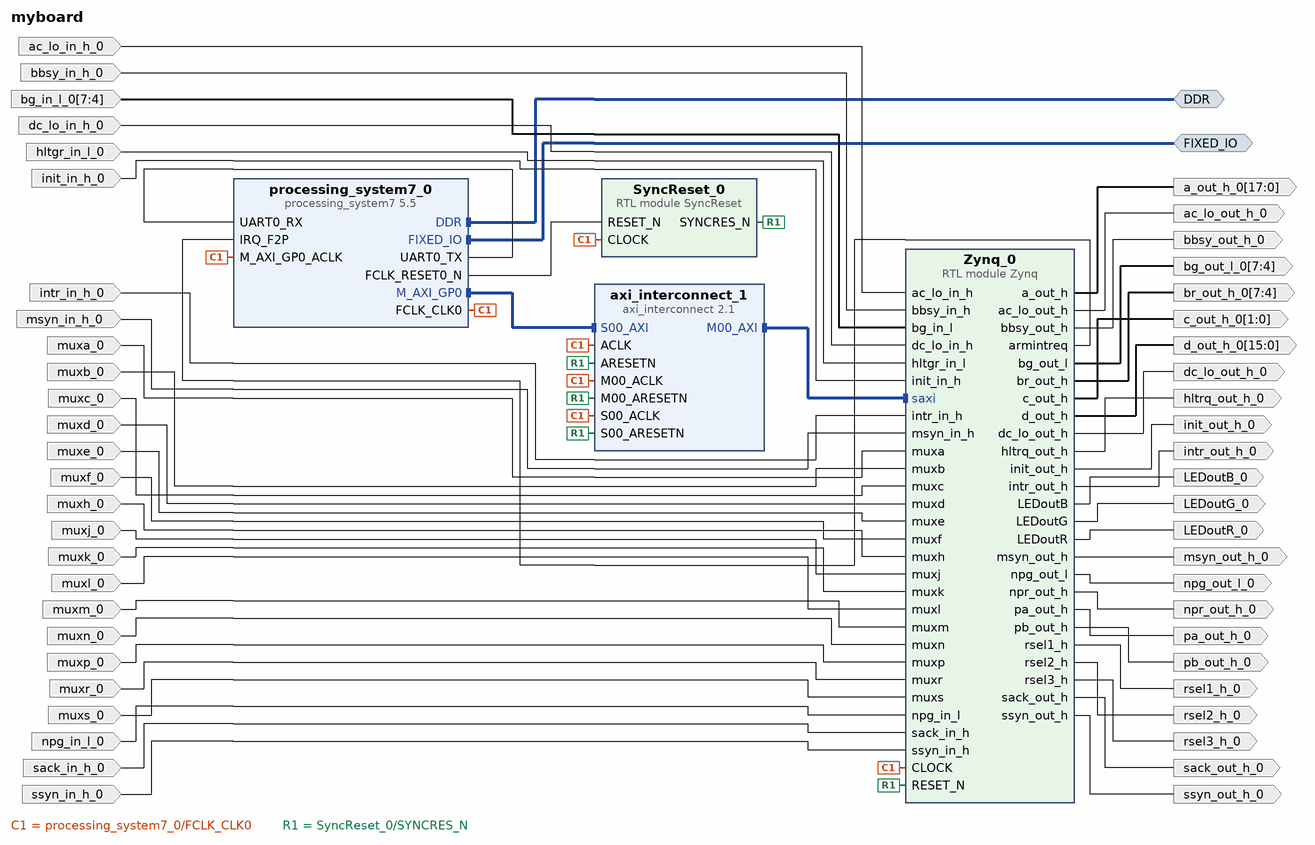
[diagram p0: block diagram of the top level]
# Vivado block design myboard, xc7z020clg400-1, Vivado 2018.3
create_bd_design myboard

create_bd_intf_port -mode Master -vlnv xilinx.com:interface:ddrx_rtl:1.0 DDR
create_bd_intf_port -mode Master -vlnv xilinx.com:display_processing_system7:fixedio_rtl:1.0 FIXED_IO
create_bd_port -dir O -type data LEDoutB_0
create_bd_port -dir O -type data LEDoutG_0
create_bd_port -dir O -type data LEDoutR_0
create_bd_port -dir O -from 17 -to 0 a_out_h_0
create_bd_port -dir I ac_lo_in_h_0
create_bd_port -dir O ac_lo_out_h_0
create_bd_port -dir I bbsy_in_h_0
create_bd_port -dir O bbsy_out_h_0
create_bd_port -dir I -from 7 -to 4 bg_in_l_0
create_bd_port -dir O -from 7 -to 4 bg_out_l_0
create_bd_port -dir O -from 7 -to 4 br_out_h_0
create_bd_port -dir O -from 1 -to 0 c_out_h_0
create_bd_port -dir O -from 15 -to 0 d_out_h_0
create_bd_port -dir I dc_lo_in_h_0
create_bd_port -dir O dc_lo_out_h_0
create_bd_port -dir I hltgr_in_l_0
create_bd_port -dir O hltrq_out_h_0
create_bd_port -dir I init_in_h_0
create_bd_port -dir O init_out_h_0
create_bd_port -dir I intr_in_h_0
create_bd_port -dir O intr_out_h_0
create_bd_port -dir I msyn_in_h_0
create_bd_port -dir O msyn_out_h_0
create_bd_port -dir I muxa_0
create_bd_port -dir I muxb_0
create_bd_port -dir I muxc_0
create_bd_port -dir I muxd_0
create_bd_port -dir I muxe_0
create_bd_port -dir I muxf_0
create_bd_port -dir I muxh_0
create_bd_port -dir I muxj_0
create_bd_port -dir I muxk_0
create_bd_port -dir I muxl_0
create_bd_port -dir I muxm_0
create_bd_port -dir I muxn_0
create_bd_port -dir I muxp_0
create_bd_port -dir I muxr_0
create_bd_port -dir I muxs_0
create_bd_port -dir I npg_in_l_0
create_bd_port -dir O npg_out_l_0
create_bd_port -dir O npr_out_h_0
create_bd_port -dir O pa_out_h_0
create_bd_port -dir O pb_out_h_0
create_bd_port -dir O rsel1_h_0
create_bd_port -dir O rsel2_h_0
create_bd_port -dir O rsel3_h_0
create_bd_port -dir I sack_in_h_0
create_bd_port -dir O sack_out_h_0
create_bd_port -dir I ssyn_in_h_0
create_bd_port -dir O ssyn_out_h_0

create_bd_cell -type module -reference SyncReset SyncReset_0
create_bd_cell -type module -reference Zynq Zynq_0
create_bd_cell -type ip -vlnv xilinx.com:ip:axi_interconnect:2.1 axi_interconnect_1
set_property -dict {CONFIG.NUM_MI 1} [get_bd_cells axi_interconnect_1]
create_bd_cell -type ip -vlnv xilinx.com:ip:processing_system7:5.5 processing_system7_0
set_property -dict [list \
  CONFIG.PCW_APU_PERIPHERAL_FREQMHZ 666.666666 \
  CONFIG.PCW_CAN0_CAN0_IO {MIO 14 .. 15} \
  CONFIG.PCW_CAN0_PERIPHERAL_ENABLE 1 \
  CONFIG.PCW_ENET0_ENET0_IO {MIO 16 .. 27} \
  CONFIG.PCW_ENET0_GRP_MDIO_ENABLE 1 \
  CONFIG.PCW_ENET0_GRP_MDIO_IO {MIO 52 .. 53} \
  CONFIG.PCW_ENET0_PERIPHERAL_CLKSRC {ARM PLL} \
  CONFIG.PCW_ENET0_PERIPHERAL_ENABLE 1 \
  CONFIG.PCW_ENET0_RESET_ENABLE 0 \
  CONFIG.PCW_ENET_RESET_ENABLE 1 \
  CONFIG.PCW_ENET_RESET_SELECT {Share reset pin} \
  CONFIG.PCW_EN_CLK1_PORT 1 \
  CONFIG.PCW_FCLK_CLK1_BUF TRUE \
  CONFIG.PCW_FPGA0_PERIPHERAL_FREQMHZ 100 \
  CONFIG.PCW_FPGA1_PERIPHERAL_FREQMHZ 50 \
  CONFIG.PCW_FPGA_FCLK1_ENABLE 1 \
  CONFIG.PCW_GPIO_MIO_GPIO_ENABLE 1 \
  CONFIG.PCW_GPIO_MIO_GPIO_IO MIO \
  CONFIG.PCW_GPIO_PERIPHERAL_ENABLE 1 \
  CONFIG.PCW_I2C0_I2C0_IO EMIO \
  CONFIG.PCW_I2C0_PERIPHERAL_ENABLE 1 \
  CONFIG.PCW_I2C1_I2C1_IO {MIO 12 .. 13} \
  CONFIG.PCW_I2C1_PERIPHERAL_ENABLE 1 \
  CONFIG.PCW_I2C_PERIPHERAL_FREQMHZ 83.333336 \
  CONFIG.PCW_I2C_RESET_ENABLE 1 \
  CONFIG.PCW_I2C_RESET_SELECT {Share reset pin} \
  CONFIG.PCW_IRQ_F2P_INTR 1 \
  CONFIG.PCW_PRESET_BANK1_VOLTAGE {LVCMOS 1.8V} \
  CONFIG.PCW_QSPI_GRP_FBCLK_ENABLE 1 \
  CONFIG.PCW_QSPI_GRP_FBCLK_IO {MIO 8} \
  CONFIG.PCW_QSPI_GRP_SINGLE_SS_ENABLE 1 \
  CONFIG.PCW_QSPI_GRP_SINGLE_SS_IO {MIO 1 .. 6} \
  CONFIG.PCW_QSPI_PERIPHERAL_ENABLE 1 \
  CONFIG.PCW_QSPI_QSPI_IO {MIO 1 .. 6} \
  CONFIG.PCW_SD0_GRP_CD_ENABLE 1 \
  CONFIG.PCW_SD0_GRP_CD_IO {MIO 46} \
  CONFIG.PCW_SD0_GRP_WP_ENABLE 1 \
  CONFIG.PCW_SD0_GRP_WP_IO {MIO 47} \
  CONFIG.PCW_SD0_PERIPHERAL_ENABLE 1 \
  CONFIG.PCW_SD0_SD0_IO {MIO 40 .. 45} \
  CONFIG.PCW_SDIO_PERIPHERAL_FREQMHZ 100 \
  CONFIG.PCW_SINGLE_QSPI_DATA_MODE x4 \
  CONFIG.PCW_TTC0_PERIPHERAL_ENABLE 1 \
  CONFIG.PCW_TTC0_TTC0_IO EMIO \
  CONFIG.PCW_UART0_PERIPHERAL_ENABLE 1 \
  CONFIG.PCW_UART0_UART0_IO EMIO \
  CONFIG.PCW_UART1_PERIPHERAL_ENABLE 1 \
  CONFIG.PCW_UART1_UART1_IO {MIO 48 .. 49} \
  CONFIG.PCW_UART_PERIPHERAL_FREQMHZ 100 \
  CONFIG.PCW_UIPARAM_DDR_PARTNO {MT41J256M16 RE-125} \
  CONFIG.PCW_USB0_PERIPHERAL_ENABLE 1 \
  CONFIG.PCW_USB0_RESET_ENABLE 1 \
  CONFIG.PCW_USB0_RESET_IO {MIO 51} \
  CONFIG.PCW_USB0_USB0_IO {MIO 28 .. 39} \
  CONFIG.PCW_USB_RESET_ENABLE 1 \
  CONFIG.PCW_USB_RESET_SELECT {Share reset pin} \
  CONFIG.PCW_USE_FABRIC_INTERRUPT 1 \
] [get_bd_cells processing_system7_0]
# 287 more settings of processing_system7_0 are not shown: defaults, MIO pin electricals, DDR timing, and values the tool derives

# ---- connections ----

connect_bd_intf_net [get_bd_intf_pins axi_interconnect_1/M00_AXI] [get_bd_intf_pins Zynq_0/saxi]
connect_bd_intf_net [get_bd_intf_ports DDR] [get_bd_intf_pins processing_system7_0/DDR]
connect_bd_intf_net [get_bd_intf_ports FIXED_IO] [get_bd_intf_pins processing_system7_0/FIXED_IO]
connect_bd_intf_net [get_bd_intf_pins processing_system7_0/M_AXI_GP0] [get_bd_intf_pins axi_interconnect_1/S00_AXI]
connect_bd_net [get_bd_pins Zynq_0/LEDoutB] [get_bd_ports LEDoutB_0]
connect_bd_net [get_bd_pins Zynq_0/LEDoutG] [get_bd_ports LEDoutG_0]
connect_bd_net [get_bd_pins Zynq_0/LEDoutR] [get_bd_ports LEDoutR_0]
connect_bd_net [get_bd_pins Zynq_0/a_out_h] [get_bd_ports a_out_h_0]
connect_bd_net [get_bd_pins Zynq_0/ac_lo_out_h] [get_bd_ports ac_lo_out_h_0]
connect_bd_net [get_bd_pins Zynq_0/armintreq] [get_bd_pins processing_system7_0/IRQ_F2P]
connect_bd_net [get_bd_pins Zynq_0/bbsy_out_h] [get_bd_ports bbsy_out_h_0]
connect_bd_net [get_bd_pins Zynq_0/bg_out_l] [get_bd_ports bg_out_l_0]
connect_bd_net [get_bd_pins Zynq_0/br_out_h] [get_bd_ports br_out_h_0]
connect_bd_net [get_bd_pins Zynq_0/c_out_h] [get_bd_ports c_out_h_0]
connect_bd_net [get_bd_pins Zynq_0/d_out_h] [get_bd_ports d_out_h_0]
connect_bd_net [get_bd_pins Zynq_0/dc_lo_out_h] [get_bd_ports dc_lo_out_h_0]
connect_bd_net [get_bd_pins Zynq_0/hltrq_out_h] [get_bd_ports hltrq_out_h_0]
connect_bd_net [get_bd_pins Zynq_0/init_out_h] [get_bd_ports init_out_h_0]
connect_bd_net [get_bd_pins Zynq_0/intr_out_h] [get_bd_ports intr_out_h_0]
connect_bd_net [get_bd_pins Zynq_0/msyn_out_h] [get_bd_ports msyn_out_h_0]
connect_bd_net [get_bd_pins Zynq_0/npg_out_l] [get_bd_ports npg_out_l_0]
connect_bd_net [get_bd_pins Zynq_0/npr_out_h] [get_bd_ports npr_out_h_0]
connect_bd_net [get_bd_pins Zynq_0/pa_out_h] [get_bd_ports pa_out_h_0]
connect_bd_net [get_bd_pins Zynq_0/pb_out_h] [get_bd_ports pb_out_h_0]
connect_bd_net [get_bd_pins Zynq_0/rsel1_h] [get_bd_ports rsel1_h_0]
connect_bd_net [get_bd_pins Zynq_0/rsel2_h] [get_bd_ports rsel2_h_0]
connect_bd_net [get_bd_pins Zynq_0/rsel3_h] [get_bd_ports rsel3_h_0]
connect_bd_net [get_bd_pins Zynq_0/sack_out_h] [get_bd_ports sack_out_h_0]
connect_bd_net [get_bd_pins Zynq_0/ssyn_out_h] [get_bd_ports ssyn_out_h_0]
connect_bd_net -net ac_lo_in_h_0_1 [get_bd_ports ac_lo_in_h_0] [get_bd_pins Zynq_0/ac_lo_in_h]
connect_bd_net -net bbsy_in_h_0_1 [get_bd_ports bbsy_in_h_0] [get_bd_pins Zynq_0/bbsy_in_h]
connect_bd_net -net bg_in_l_0_1 [get_bd_ports bg_in_l_0] [get_bd_pins Zynq_0/bg_in_l]
connect_bd_net -net dc_lo_in_h_0_1 [get_bd_ports dc_lo_in_h_0] [get_bd_pins Zynq_0/dc_lo_in_h]
connect_bd_net -net hltgr_in_l_0_1 [get_bd_ports hltgr_in_l_0] [get_bd_pins Zynq_0/hltgr_in_l]
connect_bd_net -net init_in_h_0_1 [get_bd_ports init_in_h_0] [get_bd_pins Zynq_0/init_in_h]
connect_bd_net -net intr_in_h_0_1 [get_bd_ports intr_in_h_0] [get_bd_pins Zynq_0/intr_in_h]
connect_bd_net -net msyn_in_h_0_1 [get_bd_ports msyn_in_h_0] [get_bd_pins Zynq_0/msyn_in_h]
connect_bd_net -net muxa_0_1 [get_bd_ports muxa_0] [get_bd_pins Zynq_0/muxa]
connect_bd_net -net muxb_0_1 [get_bd_ports muxb_0] [get_bd_pins Zynq_0/muxb]
connect_bd_net -net muxc_0_1 [get_bd_ports muxc_0] [get_bd_pins Zynq_0/muxc]
connect_bd_net -net muxd_0_1 [get_bd_ports muxd_0] [get_bd_pins Zynq_0/muxd]
connect_bd_net -net muxe_0_1 [get_bd_ports muxe_0] [get_bd_pins Zynq_0/muxe]
connect_bd_net -net muxf_0_1 [get_bd_ports muxf_0] [get_bd_pins Zynq_0/muxf]
connect_bd_net -net muxh_0_1 [get_bd_ports muxh_0] [get_bd_pins Zynq_0/muxh]
connect_bd_net -net muxj_0_1 [get_bd_ports muxj_0] [get_bd_pins Zynq_0/muxj]
connect_bd_net -net muxk_0_1 [get_bd_ports muxk_0] [get_bd_pins Zynq_0/muxk]
connect_bd_net -net muxl_0_1 [get_bd_ports muxl_0] [get_bd_pins Zynq_0/muxl]
connect_bd_net -net muxm_0_1 [get_bd_ports muxm_0] [get_bd_pins Zynq_0/muxm]
connect_bd_net -net muxn_0_1 [get_bd_ports muxn_0] [get_bd_pins Zynq_0/muxn]
connect_bd_net -net muxp_0_1 [get_bd_ports muxp_0] [get_bd_pins Zynq_0/muxp]
connect_bd_net -net muxr_0_1 [get_bd_ports muxr_0] [get_bd_pins Zynq_0/muxr]
connect_bd_net -net muxs_0_1 [get_bd_ports muxs_0] [get_bd_pins Zynq_0/muxs]
connect_bd_net -net npg_in_l_0_1 [get_bd_ports npg_in_l_0] [get_bd_pins Zynq_0/npg_in_l]
connect_bd_net [get_bd_pins processing_system7_0/FCLK_CLK0] \
  [get_bd_pins axi_interconnect_1/S00_ACLK] [get_bd_pins axi_interconnect_1/M00_ACLK] [get_bd_pins axi_interconnect_1/ACLK] \
  [get_bd_pins processing_system7_0/M_AXI_GP0_ACLK] [get_bd_pins SyncReset_0/CLOCK] [get_bd_pins Zynq_0/CLOCK]
connect_bd_net -net processing_system7_0_FCLK_RESET0_N [get_bd_pins SyncReset_0/SYNCRES_N] \
  [get_bd_pins axi_interconnect_1/M00_ARESETN] [get_bd_pins axi_interconnect_1/S00_ARESETN] \
  [get_bd_pins axi_interconnect_1/ARESETN] [get_bd_pins Zynq_0/RESET_N]
connect_bd_net [get_bd_pins processing_system7_0/FCLK_RESET0_N] [get_bd_pins SyncReset_0/RESET_N]
connect_bd_net [get_bd_pins processing_system7_0/UART0_TX] [get_bd_pins processing_system7_0/UART0_RX]
connect_bd_net -net sack_in_h_0_1 [get_bd_ports sack_in_h_0] [get_bd_pins Zynq_0/sack_in_h]
connect_bd_net -net ssyn_in_h_0_1 [get_bd_ports ssyn_in_h_0] [get_bd_pins Zynq_0/ssyn_in_h]

# ---- address map ----
assign_bd_address -offset 0x43C00000 -range 4K -target_address_space [get_bd_addr_spaces processing_system7_0/Data] [get_bd_addr_segs Zynq_0/saxi/reg0]

validate_bd_design
save_bd_design
